# Altium schematic sheet RS-485.SchDoc
size A4; DocumentNumber: 3; SheetNumber: 3; SheetTotal: 5
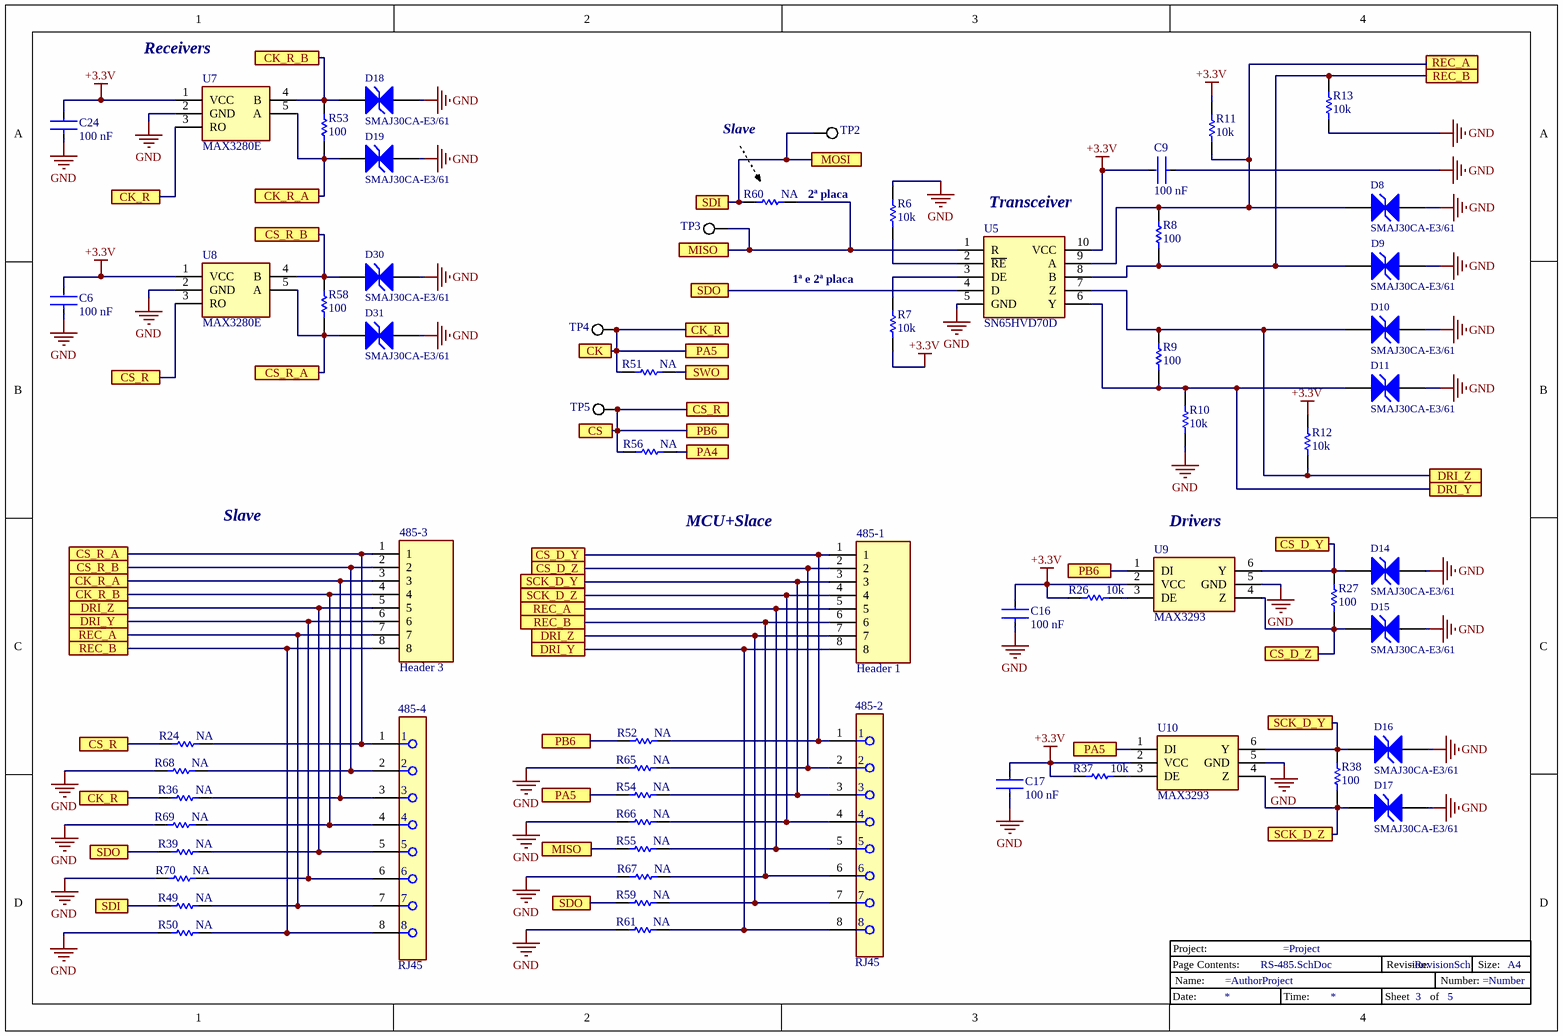
[diagram p0: RS-485.SchDoc]

## Parts
485-1  Header 1  [SHDRRA8W64P0X250_1X8_2250X820X420P]
485-2  RJ45  [FP-RJHSE-5080-MFG]
485-3  Header 3  [SHDRRA8W64P0X250_1X8_2250X820X420P]
485-4  RJ45  [FP-RJHSE-5080-MFG]
C6  100 nF  [FP-CC0603-DA-MFG]
C9  100 nF  [FP-CC0603-DA-MFG]
C16  100 nF  [FP-CC0603-DA-MFG]
C17  100 nF  [FP-CC0603-DA-MFG]
C24  100 nF  [FP-CC0603-DA-MFG]
D8  SMAJ30CA-E3/61  [VISH-DO-214AC-2_L]
D9  SMAJ30CA-E3/61  [VISH-DO-214AC-2_L]
D10  SMAJ30CA-E3/61  [VISH-DO-214AC-2_L]
D11  SMAJ30CA-E3/61  [VISH-DO-214AC-2_L]
D14  SMAJ30CA-E3/61  [VISH-DO-214AC-2_L]
D15  SMAJ30CA-E3/61  [VISH-DO-214AC-2_L]
D16  SMAJ30CA-E3/61  [VISH-DO-214AC-2_L]
D17  SMAJ30CA-E3/61  [VISH-DO-214AC-2_L]
D18  SMAJ30CA-E3/61  [VISH-DO-214AC-2_L]
D19  SMAJ30CA-E3/61  [VISH-DO-214AC-2_L]
D30  SMAJ30CA-E3/61  [VISH-DO-214AC-2_L]
D31  SMAJ30CA-E3/61  [VISH-DO-214AC-2_L]
R6  10k  [RESC1608X55X25ML10T15]
R7  10k  [RESC1608X55X25ML10T15]
R8  100  [RESC1608X55X25ML10T15]
R9  100  [RESC1608X55X25ML10T15]
R10  10k  [RESC1608X55X25ML10T15]
R11  10k  [RESC1608X55X25ML10T15]
R12  10k  [RESC1608X55X25ML10T15]
R13  10k  [RESC1608X55X25ML10T15]
R24  NA  [RESC1608X55X25ML10T15]
R26  10k  [RESC1608X55X25ML10T15]
R27  100  [RESC1608X55X25ML10T15]
R36  NA  [RESC1608X55X25ML10T15]
R37  10k  [RESC1608X55X25ML10T15]
R38  100  [RESC1608X55X25ML10T15]
R39  NA  [RESC1608X55X25ML10T15]
R49  NA  [RESC1608X55X25ML10T15]
R50  NA  [RESC1608X55X25ML10T15]
R51  NA  [RESC1608X55X25ML10T15]
R52  NA  [RESC1608X55X25ML10T15]
R53  100  [RESC1608X55X25ML10T15]
R54  NA  [RESC1608X55X25ML10T15]
R55  NA  [RESC1608X55X25ML10T15]
R56  NA  [RESC1608X55X25ML10T15]
R58  100  [RESC1608X55X25ML10T15]
R59  NA  [RESC1608X55X25ML10T15]
R60  NA  [RESC1608X55X25ML10T15]
R61  NA  [RESC1608X55X25ML10T15]
R65  NA  [RESC1608X55X25ML10T15]
R66  NA  [RESC1608X55X25ML10T15]
R67  NA  [RESC1608X55X25ML10T15]
R68  NA  [RESC1608X55X25ML10T15]
R69  NA  [RESC1608X55X25ML10T15]
R70  NA  [RESC1608X55X25ML10T15]
Title_Block_3  Title_Block  (value not drawn)
TP2  5000  [KSTN-5002]  (value not drawn)
TP3  5000  [KSTN-5002]  (value not drawn)
TP4  5000  [KSTN-5002]  (value not drawn)
TP5  5000  [KSTN-5002]  (value not drawn)
U5  SN65HVD70D  [SOP50P490X110-10N]
U7  MAX3280E  [SOT95P280X145-5N]
U8  MAX3280E  [SOT95P280X145-5N]
U9  MAX3293  [SOT95P280X145-6N]
U10  MAX3293  [SOT95P280X145-6N]

## Ports
CK, CK_R, CK_R_A, CK_R_B, CS, CS_D_Y, CS_D_Z, CS_R, CS_R_A, CS_R_B, DRI_Y, DRI_Z, MISO, MOSI, PA4, PA5, PB6, REC_A, REC_B, SCK_D_Y, SCK_D_Z, SDI, SDO, SWO

## Nets
+3.3V: C6.2 C9.2 C16.2 C17.2 C24.2 R7.1 R11.2 R12.2 R26.1 R37.1 U5.10(VCC) U7.1(VCC) U8.1(VCC) U9.2(VCC) U10.2(VCC)
GND: C6.1 C9.1 C16.1 C17.1 C24.1 D8.1(A1) D9.1(A1) D10.1(A1) D11.1(A1) D14.1(A1) D15.1(A1) D16.1(A1) D17.1(A1) D18.1(A1) D19.1(A1) D30.1(A1) D31.1(A1) R6.2 R10.1 R13.1 R50.1 R61.1 R65.1 R66.1 R67.1 R68.1 R69.1 R70.1 U5.5(GND) U7.2(GND) U8.2(GND) U9.5(GND) U10.5(GND)
CK: R36.1 R51.1 R54.1 TP4.1 U7.3(RO) U10.1(DI) ; port CK_R, port PA5, port CK
CK_R_A: 485-3.3 485-4.3 D19.2(A2) R36.2 R53.1 U7.5(A) ; port CK_R_A
CK_R_B: 485-3.4 485-4.4 D18.2(A2) R53.2 R69.2 U7.4(B) ; port CK_R_B
CS: R24.1 R52.1 R56.1 TP5.1 U8.3(RO) U9.1(DI) ; port CS_R, port PB6, port CS
CS_D_Y: 485-1.1 485-2.1 D14.2(A2) R27.2 R52.2 U9.6(Y) ; port CS_D_Y
CS_D_Z: 485-1.2 485-2.2 D15.2(A2) R27.1 R65.2 U9.4(Z) ; port CS_D_Z
CS_R_A: 485-3.1 485-4.1 D31.2(A2) R24.2 R58.1 U8.5(A) ; port CS_R_A
CS_R_B: 485-3.2 485-4.2 D30.2(A2) R58.2 R68.2 U8.4(B) ; port CS_R_B
DRI_Y: 485-1.8 485-2.8 485-3.6 485-4.6 D11.2(A2) R9.1 R10.2 R61.2 R70.2 U5.6(Y) ; port DRI_Y
DRI_Z: 485-1.7 485-2.7 485-3.5 485-4.5 D10.2(A2) R9.2 R12.1 R39.2 R59.2 U5.7(Z) ; port DRI_Z
MISO: R55.1 R60.2 TP3.1 U5.1(R) ; port MISO
MOSI: R49.1 R60.1 TP2.1 ; port SDI, port MOSI
PA4: R56.2 ; port PA4
REC_A: 485-1.5 485-2.5 485-3.7 485-4.7 D8.2(A2) R8.2 R11.1 R49.2 R55.2 U5.9(A) ; port REC_A
REC_B: 485-1.6 485-2.6 485-3.8 485-4.8 D9.2(A2) R8.1 R13.2 R50.2 R67.2 U5.8(B) ; port REC_B
SCK_D_Y: 485-1.3 485-2.3 D16.2(A2) R38.2 R54.2 U10.6(Y) ; port SCK_D_Y
SCK_D_Z: 485-1.4 485-2.4 D17.2(A2) R38.1 R66.2 U10.4(Z) ; port SCK_D_Z
SDO: R39.1 R59.1 U5.4(D) ; port SDO
SWO: R51.2 ; port SWO
NetR6_1: R6.1 U5.2(~{RE})
NetR7_2: R7.2 U5.3(DE)
NetR26_2: R26.2 U9.3(DE)
NetR37_2: R37.2 U10.3(DE)

## Notes on the sheet
- (near U7) Receivers
- Slave
- 2ª placa
- (near U5) Transceiver
- 1ª e 2ª placa
- MCU+Slace
- (near U9) Drivers
- (in symbol Title_Block) Project:; Page Contents:; Revision:; Size:; A4; Name:; Number:; Date:; Time:; Sheet; of

## Library data of the parts
485-1 485-3 = S8B-EH_LF__SN_: Conector Femea 1*8 90 graus; Manufacturer_Name: JST (JAPAN SOLDERLESS TERMINALS); Manufacturer_Part_Number: S8B-EH(LF)(SN); Datasheet Link: http://www.jst-mfg.com/product/pdf/eng/eEH.pdf; Height: 4.2mm; Arrow Part Number: S8B-EH(LF)(SN); Arrow Price/Stock: https://www.arrow.com/en/products/s8b-eh-lf-sn/jst-manufacturing
485-2 485-4 = CMP-02366-000003-1: CONN MOD JACK 8P8C R/A UNSHLD; Manufacturer: Amphenol; Current Rating: 1.5A; Voltage Rating: 125V; Pitch: 1.02mm; Conn Orientation: Right Angle; Number Of Contacts: 8; Is Female: yes; Conn Gender: Female; Lead Free: Yes; Device Class L3: unset; Footprint Url: https://cdn.amphenol-icc.com/media/wysiwyg/files/drawing/rjhse5080.pdf?__cf_chl_jschl_tk__=e349db0bbbb6188a39347cd5e541b92fa02c9719-1587748343-0-AW7tChdeHzRPLX9gSWj7WrKaXQoY9BsmT9Ek0h-T62M9y3Rs9iypFcOtkzb-6sGYQEjFE-jcoNciDETCOZrh1rYyOesac5SvYLoLwHIsHvF4AKBlx-MXmfZUVk9OTTJLqyQq2qMm0PFRLJpNcK0nrKResqOniRSYixG2sPTmOPraH-ULJFBDL602CHqcI9KKBgTq90Jh1OL2Td4moJ99rFsJRJ1Tk_uoxGe8ublcP_ARu-uLpWcQrBcwOcHDTAwL29DAwVaqcH7ta8Ks7WMlHmVl_pILeEDwT0bE9vu5Pa5S3PtNRF1leuFkgi_FMbUxTDulc5xzbXSfng8srUIV1lWXny5nx1fZJEUa_w97yKjffzBMxiWLWVN-V7-uqAaPbyv_m-wRyw5O25OZNyJOeGU; ComponentLink2URL: https://cdn.amphenol-icc.com/media/wysiwyg/files/documentation/datasheet/inputoutput/io-modjack-rjhse.pdf; Device Class L1: Connectors; Package: CONN_MOD_JACK; Mouser Description: Modular Connectors / Ethernet Connectors R/A RJ45 NONSHIELDED 8 CONT NO LEDS; Manufacturer Part Number: RJHSE-5080; Octopart: https://octopart.com/rjhse-5080-amphenol-45060; Category: Conn; Height: 0.535inch; Temperature: -55°C to +85°C; Digikey Description: CONN MOD JACK 8P8C R/A UNSHLD; Device Class L2: Modular / Ethernet Connectors; Contact Material: Gold,Nickel; ComponentLink2Description: Datasheet; Temperature Range Low: -55°C; RoHS: TRUE; Automotive: No; Temperature Range High: +85°C
C6 C9 C16 C17 C24 = CMP-2100-03601-2: CAP CER 0.1UF 50V X7R 0603; Manufacturer: YAGEO; Manufacturer Part Number: CC0603KRX7R9BB104; Material: Ceramic; Temperature Coefficient: 15%; Tolerance: 0.1; Height: 0.9mm; Voltage: 50 V; ComponentLink2Description: Datasheet; Device Class L2: Capacitors; Temperature Range High: +125°C; Category: Cap; Capacitance: 100 nF; Footprint Url: http://www.yageo.com/exep/pages/download/literatures/UPY-C_GEN_24.pdf; ComponentLink2URL: http://www.yageo.com/documents/recent/UPY-GPHC_X7R_6.3V-to-50V_18.pdf; Package: CC0603-DA; Temperature: -55°C to +125°C; Voltage Rating: 50 V; Temperature Characteristic: X7R; Device Class L1: Passive Components; Temperature Range Low: -55°C; RoHS: TRUE; Automotive: No; Value: 100 nF; Device Class L3: Ceramic Capacitors; Octopart: https://octopart.com/cc0603krx7r9bb104-yageo-42244635; Mouser Description: Multilayer Ceramic Capacitor, CC Series, 0.1 - F, - 10%, X7R, 50 V, 0603 [1608 Metric]; Lead Free: Yes; Digikey Description: CAP CER 0.1UF 50V X7R 0603
D8-D11 D14-D19 D30 D31 = CMP-0548-00185-2: Transient Voltage Suppressor, 6.40 to 231 V, 30 V Stand-off Voltage, Bi-Directional, -55 to 155 degC, 2-pin DO-214AC, Pb-Free, Tape and Reel; Manufacturer: Vishay Semiconductor; ID (uA): 2; IFSM: 40 A; PPPM (W): 400, 300; VWM (V): 30; VBR Bi-Directional (V): 6.4 to 231; PartNumber: SMAJ30CA-E3/61; Mounting Technology: Surface Mount; Operating Junction and Storage Temperature Range: -55 to 150 degC; ComponentLink1Description: Manufacturer URL; PackageReference: DO-214AC-2; ComponentLink3URL: http://www.vishay.com/docs/88390/smaj50a.pdf; ComponentLink2URL: http://www.vishay.com/docs/88390/smaj50a.pdf; RoHS: TRUE; DatasheetVersion: 12/8/2013; Packing: Tape and Reel; ComponentLink1URL: http://www.vishay.com/; ComponentLink2Description: Datasheet; ComponentLink3Description: Package Specification; PackageDescription: 2-Pin DO-214AC (SMA), Body 4.245 x 2.665 mm
R6 R7 R10-R13 R26 R37 = CMP-2000-05022-1: Resistor, 10 kOhm, +/- 5%, 100 mW, -55 to 155 degC, 0603 (1608 Metric), RoHS, Tape and Reel; Manufacturer: Yageo; Resistance: 10kOhms; Voltage Rating: 50V; Temperature Coefficient: 100PPM/C; Power Rating: 100mW; Package Reference: 603; Series: RC; Case Code - mm: 1608; Packaging: Reel; Datasheet URL: http://www.farnell.com/datasheets/443971.pdf; Datasheet Version: Rev. 4, 04/2009; Operating Temperature Range: -55Cto+155C; Product: ThickFilmResistorsGeneralPurpose; Package Description: 2-Pin Surface Mount Device, Body 1.6 x 0.8 mm; Manufacturer URL: http://www.yageo.com/; Case Code - in: 0603; Tolerance: 5%; Termination Style: SMD/SMT
R8 R9 R27 R38 R53 R58 = CMP-2100-03667-1: Chip Resistor, 100 Ohm, +/- 5%, 0.1 W, -55 to 155 degC, 0603 (1608 Metric), RoHS, Tape and Reel; Manufacturer: Yageo; Temperature Coefficient: 200ppm/degreesC; Voltage Rating: 50V; Power Rating: 100mW; Resistance: 0mOhm; Width: 0.8mm; Max Operating Temperature: 155degC; Tolerance: 5%; Package Reference: 0603; Height: 0.45mm; Depth: 0.8mm; Package Description: 2-Pin Surface Mount Device, Body 1.6 x 0.8 mm; Termination: SMD/SMT; Package Quantity: 5000; Case/Package: 0603; Case Code (Imperial): 0603; Radiation Hardening: No; Number of Pins: 2; Length: 1.6mm; Lead Free: LeadFree; Voltage Rating (DC): 50V; Military Standard: Not; Datasheet URL: http://www.yageo.com/NewPortal/yageodocoutput?fileName=/pdf/R-Chip/PYu-RC_Group_51_RoHS_L_5.pdf; Manufacturer URL: http://www.yageo.com/; Packaging: TapeandReel; Case Code (Metric): 1608; Min Operating Temperature: -55degC; Composition: ThickFilm; RoHSCompliant: true; Contact Plating: Tin; Datasheet Version: Rev. 5, 10/2016; REACH SVHC: NoSVHC
R24 R36 R39 R49-R52 R54-R56 R59-R61 R65-R70 = CMP-2100-03667-1: Chip Resistor, 0 Ohm, +/- 5%, 0.1 W, -55 to 155 degC, 0603 (1608 Metric), RoHS, Tape and Reel; Manufacturer: Yageo; Temperature Coefficient: 200ppm/degreesC; Voltage Rating: 50V; Power Rating: 100mW; Resistance: 0mOhm; Width: 0.8mm; Max Operating Temperature: 155degC; Tolerance: 5%; Package Reference: 0603; Height: 0.45mm; Depth: 0.8mm; Package Description: 2-Pin Surface Mount Device, Body 1.6 x 0.8 mm; Termination: SMD/SMT; Package Quantity: 5000; Case/Package: 0603; Case Code (Imperial): 0603; Radiation Hardening: No; Number of Pins: 2; Length: 1.6mm; Lead Free: LeadFree; Voltage Rating (DC): 50V; Military Standard: Not; Datasheet URL: http://www.yageo.com/NewPortal/yageodocoutput?fileName=/pdf/R-Chip/PYu-RC_Group_51_RoHS_L_5.pdf; Manufacturer URL: http://www.yageo.com/; Packaging: TapeandReel; Case Code (Metric): 1608; Min Operating Temperature: -55degC; Composition: ThickFilm; RoHSCompliant: true; Contact Plating: Tin; Datasheet Version: Rev. 5, 10/2016; REACH SVHC: NoSVHC
TP2-TP5 = CMP-2000-05182-1: Test Point, White, 1-Pin THD, RoHS, Bulk; Manufacturer: KeystoneElectronics; Outside Diameter: 2.54mm; Plating: Silver; Mounting Hole Size: 1mm; Product: TestPoints; Packaging: Bulk; Manufacturer URL: http://www.keyelco.com/; Length: 7.62mm; Datasheet Version: Rev. G, 12/2008; Type: Miniature; Product Category: CircuitBoardHardware-PCB; Material: Nylon; RoHS: True; Contact Material: PhosphorBronze; Datasheet URL: https://ciiva.com/datasheet-click-2917627?src=ciiva&sig=bd195616; Color: White; Brand: KeystoneElectronics
U5 = SN65HVD70DGS: Integrated Circuit; Manufacturer_Name: Texas Instruments; Datasheet Link: http://www.ti.com/lit/gpn/SN65HVD70; Height: 1.1mm; Manufacturer_Part_Number: SN65HVD70DGS; Mouser Part Number: 595-SN65HVD70DGS; Mouser Price/Stock: https://www.mouser.co.uk/ProductDetail/Texas-Instruments/SN65HVD70DGS?qs=7z%252BmIopC6%2FJ5%2FtvmaE7XLg%3D%3D; Arrow Part Number: SN65HVD70DGS; Arrow Price/Stock: https://www.arrow.com/en/products/sn65hvd70dgs/texas-instruments
U7 U8 = MAX3280EAUK_V+T: Integrated Circuit; Manufacturer_Name: Maxim Integrated; Manufacturer_Part_Number: MAX3280EAUK/V+T; Datasheet Link: https://datasheets.maximintegrated.com/en/ds/MAX3280E-MAX3284E.pdf; Height: 1.45mm; Mouser Part Number: 700-MAX3280EAUK/V+T; Mouser Price/Stock: https://www.mouser.co.uk/ProductDetail/Maxim-Integrated/MAX3280EAUK-V%2bT?qs=0JU57JYmZjvEM6QBFAG%2FBw%3D%3D
U9 U10 = MAX3293AUT+T: Integrated Circuit; Manufacturer_Name: Maxim Integrated; Datasheet Link: https://datasheets.maximintegrated.com/en/ds/MAX3293-MAX3295.pdf; Height: 1.45mm; Manufacturer_Part_Number: MAX3293AUT+T; Mouser Part Number: 700-MAX3293AUTT; Mouser Price/Stock: https://www.mouser.co.uk/ProductDetail/Maxim-Integrated/MAX3293AUT%2bT?qs=CDqwynd4ZNpM6TG1t4AcuA%3D%3D